# EAGLE schematic groovegrid_v2 (EAGLE 9.3.0)
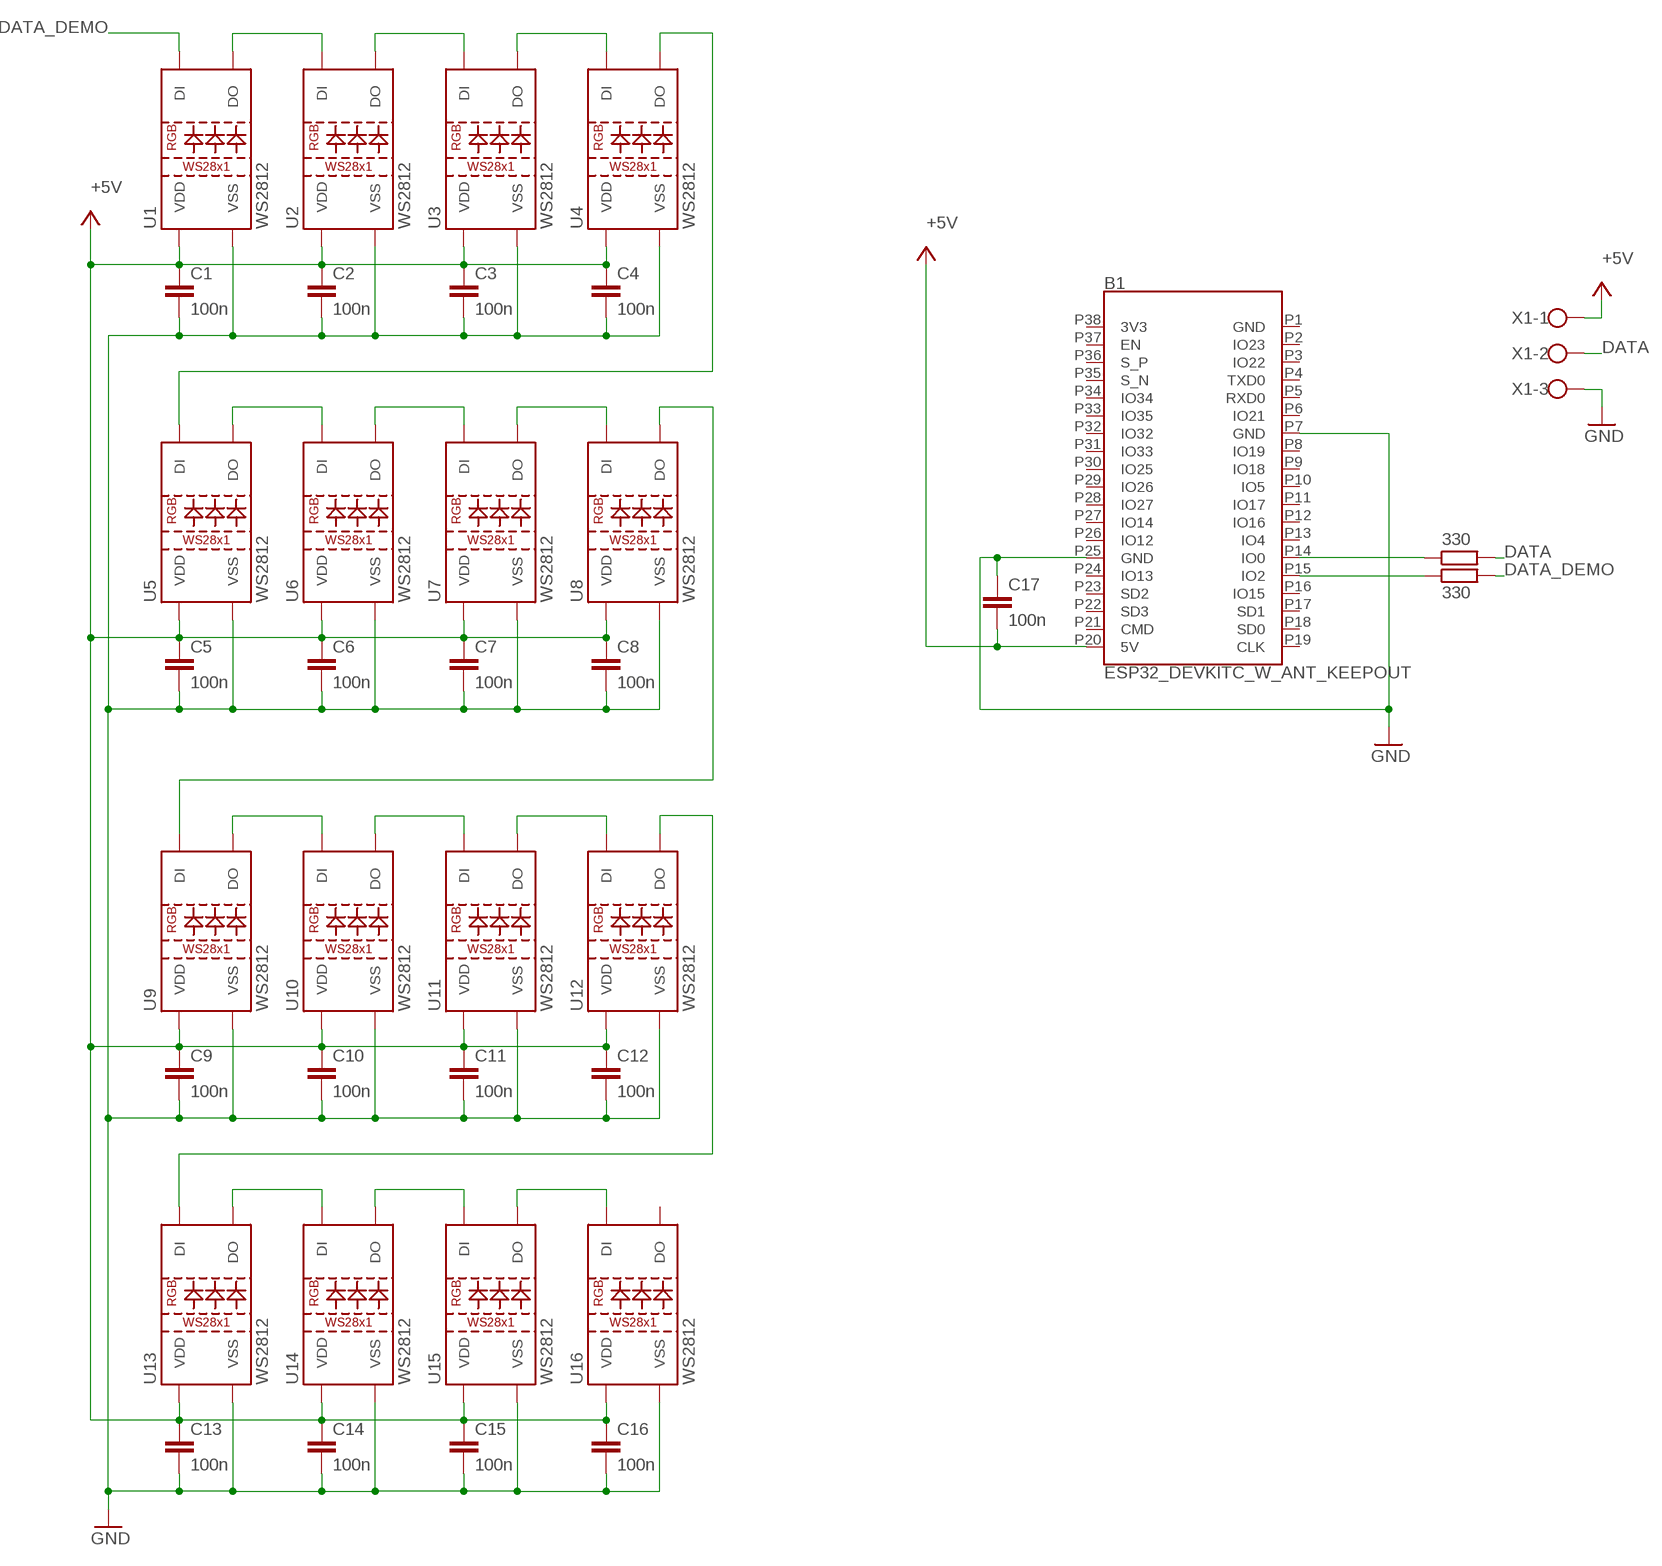
[diagram p0: schematic, sheet 1]

## Parts
B1  ESP32_DEVKITC_W_ANT_KEEPOUT  [ESP32_DEVKITC]
C1  100n  C-EUC0805  [C0805]
C2  100n  C-EUC0805  [C0805]
C3  100n  C-EUC0805  [C0805]
C4  100n  C-EUC0805  [C0805]
C5  100n  C-EUC0805  [C0805]
C6  100n  C-EUC0805  [C0805]
C7  100n  C-EUC0805  [C0805]
C8  100n  C-EUC0805  [C0805]
C9  100n  C-EUC0805  [C0805]
C10  100n  C-EUC0805  [C0805]
C11  100n  C-EUC0805  [C0805]
C12  100n  C-EUC0805  [C0805]
C13  100n  C-EUC0805  [C0805]
C14  100n  C-EUC0805  [C0805]
C15  100n  C-EUC0805  [C0805]
C16  100n  C-EUC0805  [C0805]
C17  100n  C-EUC0805  [C0805]
R1  330  R-EU_R0805  [R0805]
R2  330  R-EU_R0805  [R0805]
U1  WS2812  WS2812"  [LED-TRICOLOR-5050-IC]
U2  WS2812  WS2812"  [LED-TRICOLOR-5050-IC]
U3  WS2812  WS2812"  [LED-TRICOLOR-5050-IC]
U4  WS2812  WS2812"  [LED-TRICOLOR-5050-IC]
U5  WS2812  WS2812"  [LED-TRICOLOR-5050-IC]
U6  WS2812  WS2812"  [LED-TRICOLOR-5050-IC]
U7  WS2812  WS2812"  [LED-TRICOLOR-5050-IC]
U8  WS2812  WS2812"  [LED-TRICOLOR-5050-IC]
U9  WS2812  WS2812"  [LED-TRICOLOR-5050-IC]
U10  WS2812  WS2812"  [LED-TRICOLOR-5050-IC]
U11  WS2812  WS2812"  [LED-TRICOLOR-5050-IC]
U12  WS2812  WS2812"  [LED-TRICOLOR-5050-IC]
U13  WS2812  WS2812"  [LED-TRICOLOR-5050-IC]
U14  WS2812  WS2812"  [LED-TRICOLOR-5050-IC]
U15  WS2812  WS2812"  [LED-TRICOLOR-5050-IC]
U16  WS2812  WS2812"  [LED-TRICOLOR-5050-IC]
X1  W237-103  [W237-103]

## Nets
+5V: B1.P20(5V) C1.1 C2.1 C3.1 C4.1 C5.1 C6.1 C7.1 C8.1 C9.1 C10.1 C11.1 C12.1 C13.1 C14.1 C15.1 C16.1 C17.2 U1.3(VDD) U1.5(VDD) U2.3(VDD) U2.5(VDD) U3.3(VDD) U3.5(VDD) U4.3(VDD) U4.5(VDD) U5.3(VDD) U5.5(VDD) U6.3(VDD) U6.5(VDD) U7.3(VDD) U7.5(VDD) U8.3(VDD) U8.5(VDD) U9.3(VDD) U9.5(VDD) U10.3(VDD) U10.5(VDD) U11.3(VDD) U11.5(VDD) U12.3(VDD) U12.5(VDD) U13.3(VDD) U13.5(VDD) U14.3(VDD) U14.5(VDD) U15.3(VDD) U15.5(VDD) U16.3(VDD) U16.5(VDD) X1.1
DATA: R1.2 X1.2
DATA1: U4.1(DO) U5.2(DI)
DATA3: U12.1(DO) U13.2(DI)
DATA_DEMO: R2.2 U1.2(DI)
GND: B1.P7(GND) B1.P25(GND) C1.2 C2.2 C3.2 C4.2 C5.2 C6.2 C7.2 C8.2 C9.2 C10.2 C11.2 C12.2 C13.2 C14.2 C15.2 C16.2 C17.1 U1.6(VSS) U2.6(VSS) U3.6(VSS) U4.6(VSS) U5.6(VSS) U6.6(VSS) U7.6(VSS) U8.6(VSS) U9.6(VSS) U10.6(VSS) U11.6(VSS) U12.6(VSS) U13.6(VSS) U14.6(VSS) U15.6(VSS) U16.6(VSS) X1.3
N$1: U1.1(DO) U2.2(DI)
N$2: U2.1(DO) U3.2(DI)
N$3: U3.1(DO) U4.2(DI)
N$4: U9.1(DO) U10.2(DI)
N$5: U5.1(DO) U6.2(DI)
N$6: U6.1(DO) U7.2(DI)
N$7: U7.1(DO) U8.2(DI)
N$8: U10.1(DO) U11.2(DI)
N$9: U11.1(DO) U12.2(DI)
N$10: U13.1(DO) U14.2(DI)
N$11: U14.1(DO) U15.2(DI)
N$12: U15.1(DO) U16.2(DI)
N$13: U8.1(DO) U9.2(DI)
N$14: B1.P14(IO0) R1.1
N$15: B1.P15(IO2) R2.1
Unconnected: B1.P1(GND) B1.P2(IO23) B1.P3(IO22) B1.P4(TXD0) B1.P5(RXD0) B1.P6(IO21) B1.P8(IO19) B1.P9(IO18) B1.P10(IO5) B1.P11(IO17) B1.P12(IO16) B1.P13(IO4) B1.P16(IO15) B1.P17(SD1) B1.P18(SD0) B1.P19(CLK) B1.P21(CMD) B1.P22(SD3) B1.P23(SD2) B1.P24(IO13) B1.P26(IO12) B1.P27(IO14) B1.P28(IO27) B1.P29(IO26) B1.P30(IO25) B1.P31(IO33) B1.P32(IO32) B1.P33(IO35) B1.P34(IO34) B1.P35(S_N) B1.P36(S_P) B1.P37(EN) B1.P38(3V3) U16.1(DO)

## Library data of the parts
B1 = philmalessa:ESP32_DEVKITC: SparkFun ESP32 Thing Board Pins, silkscreen, and logos matching the layout of the SparkFun ESP32 Thing <https://www.sparkfun.com/products/13907> Dimensions: 2.32" x 1.00"; SF_ID: DEV-13907
C1-C17 = resistor:C-EU: CAPACITOR, European symbol
R1 R2 = resistor:R-EU_: RESISTOR, European symbol
U1-U16 = SparkFun-LED:WS2812: WS2812 RGB LED w/ WS2811 driver 5x5mm SMD LED with built-in controller IC. Color: Red/Green/Blue mC Rating: RGB: 550, 1100, 200 mcd Current:RGB: 20, 20, 20 mA Forward Voltage: RGB: 1.8, 3.0, 3.2 V Packages:LED-TRICOLOR-5050-IC SparkFun Products: LED-SMD RGB (WS2812) <https://www.sparkfun.com/products/11821>; PROD_ID: DIO-11598
X1 = con-wago-500:W237-103: WAGO SCREW CLAMP; MPN: 237-103; OC_FARNELL: unknown; OC_NEWARK: 18M7116